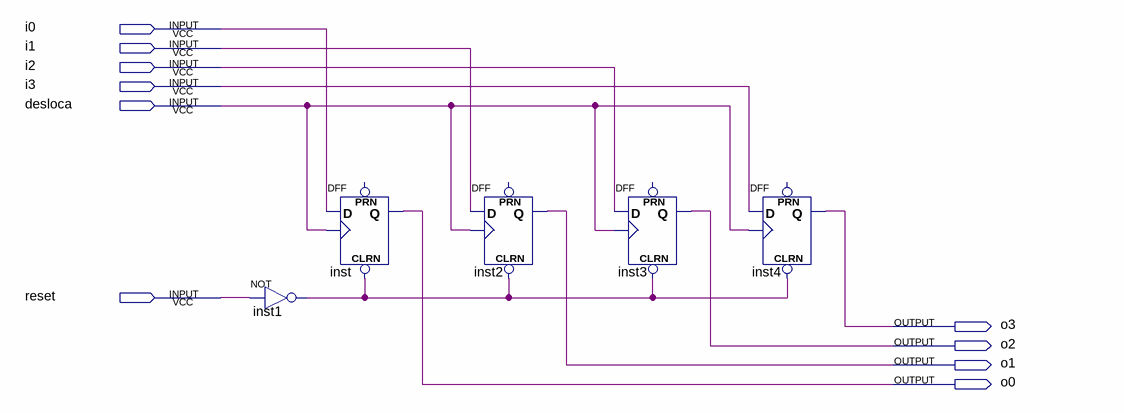
[diagram p0: schematic sheet]
// Quartus schematic piso.bdf as structural Verilog: 5 symbols, 10 pins
module piso (
  input  i0,
  input  i1,
  input  i2,
  input  i3,
  input  desloca,
  input  reset,
  output o3,
  output o2,
  output o1,
  output o0
);

  wire inst1_out;

  not inst1 (inst1_out, reset);
  DFF inst (.CLRN(inst1_out), .CLK(desloca), .D(i0), .Q(o0));  // open: PRN
  DFF inst2 (.CLRN(inst1_out), .CLK(desloca), .D(i1), .Q(o1));  // open: PRN
  DFF inst3 (.CLRN(inst1_out), .CLK(desloca), .D(i2), .Q(o2));  // open: PRN
  DFF inst4 (.CLRN(inst1_out), .CLK(desloca), .D(i3), .Q(o3));  // open: PRN
endmodule
